# EAGLE design 12vRelayDriver (EAGLE 9.6.2)
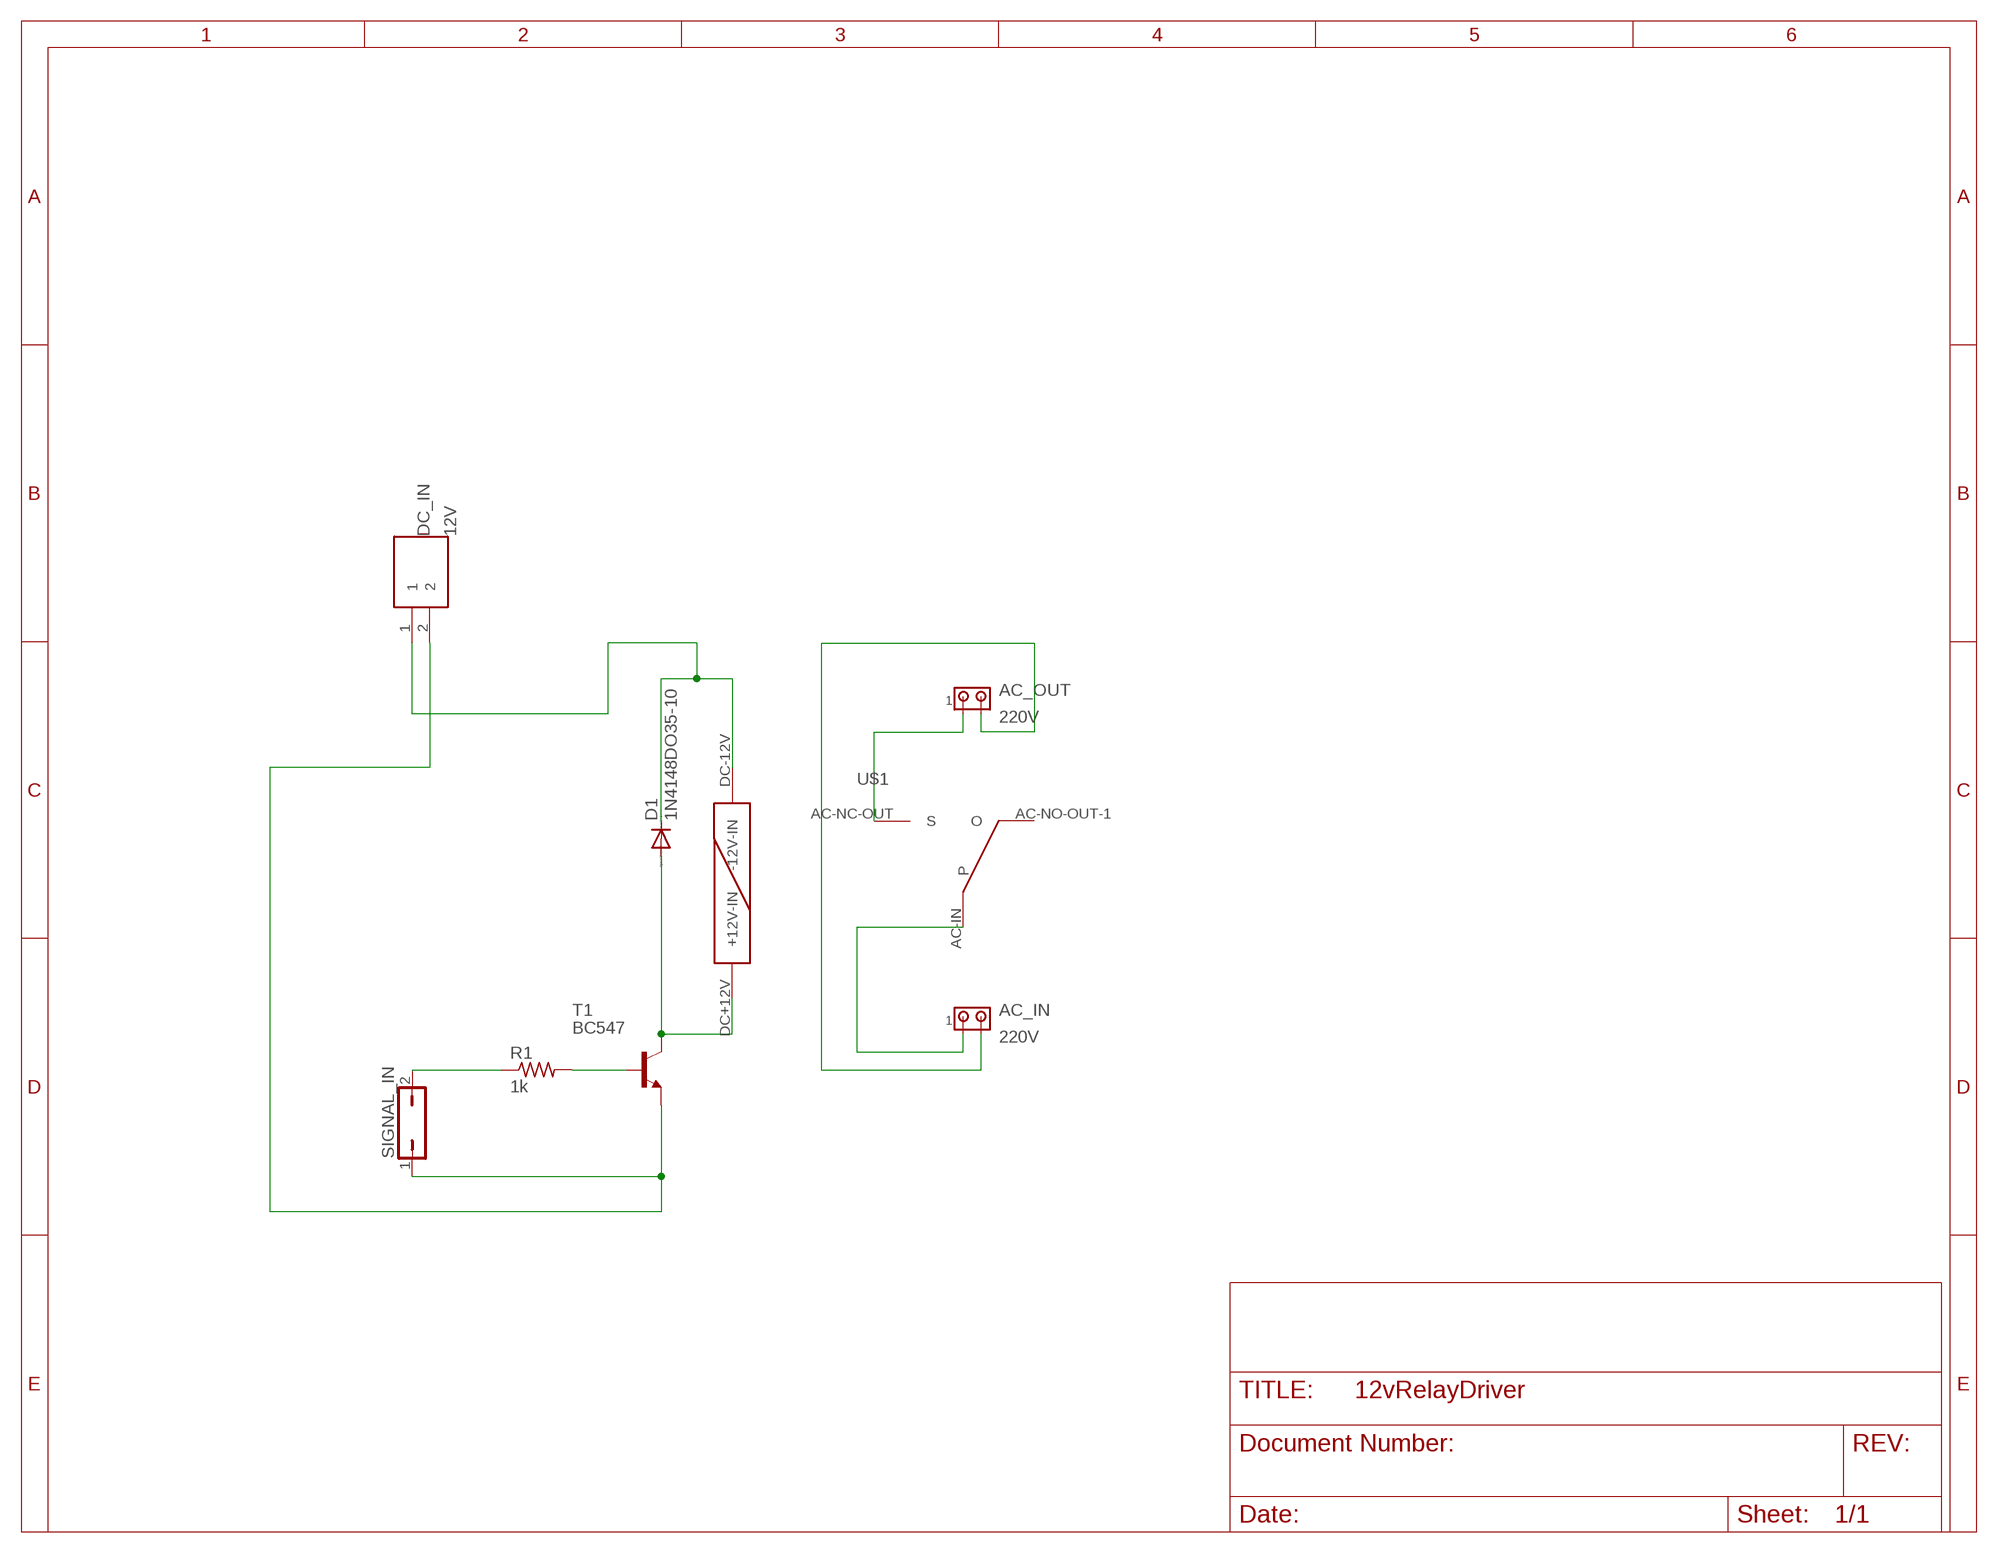
[diagram p0: schematic, sheet 1]

## Parts
AC_IN  220V  MTA02-156  [1X2MTA]
AC_OUT  220V  MTA02-156  [1X2MTA]
D1  1N4148DO35-10  [DO35-10]
DC_IN  12V  440055-2  [TE_440055-2]
R1  1k  R-US_0204/7  [0204/7]
SIGNAL_IN  JP1Q  [JP1]
T1  BC547  [TO92]
U$1  GU-D-2-6  [GU-D-2-6]

## Nets
N$1: D1.A T1.3(C) U$1.DC+12V(+12V-IN)
N$2 [AC_VOLTAGE]: AC_OUT.1 U$1.AC-NC-OUT(S)
N$3 [AC_VOLTAGE]: AC_IN.2 AC_OUT.2
N$4: R1.2 T1.2(B)
N$5: R1.1 SIGNAL_IN.2
N$6 [AC_VOLTAGE]: AC_IN.1 U$1.AC-IN(P)
N$7: D1.C DC_IN.1 U$1.DC-12V(-12V-IN)
N$8: DC_IN.2 SIGNAL_IN.1 T1.1(E)
Unconnected: U$1.AC-NO-OUT-1(O)

## Library data of the parts
AC_IN AC_OUT = con-amp:MTA02-156: AMP connector
D1 = diode:1N4148: DIODE high speed (Philips)
DC_IN = 440055-2:440055-2: Check availability <https://pricing.snapeda.com/parts/440055-2/TE%20Connectivity/view-part?ref=eda>; AVAILABILITY: In Stock; CENTERLINE_PITCH: 2 mm[.079 in]; COMMENT: 440055-2; DESCRIPTION: 2.0MM,HDR,2POS,R/A; EU_ROHS_COMPLIANCE: Compliant; MF: TE Connectivity; MP: 440055-2; NUMBER_OF_POSITIONS: 2; PACKAGE: None; PRICE: None; PRODUCT_TYPE: Connector; PURCHASE-URL: https://pricing.snapeda.com/search/part/440055-2/?ref=eda
R1 = rcl:R-US_: RESISTOR, American symbol
SIGNAL_IN = jumper:JP1Q: JUMPER
T1 = BC547:BC547: NPN TRANSISTOR; AVAILABILITY: Warning; DESCRIPTION: Trans Npn 45v 0.1a To-92; MF: Fairchild Semiconductor; MP: BC547; PACKAGE: TO-92 Fairchild Semiconductor; PRICE: 0.06 USD
U$1 = goodsky:GU-D-2-6: GoodSky GU-D T-shaped 12vDC/240VAC 30A relay (6PIN- 2 Common Terminals)

## Net classes
0 default: width 0.813 mm, drill 0.203 mm, clearance 0.203 mm
1 AC_VOLTAGE: width 1.626 mm, drill 0.254 mm, clearance 0.203 mm

## Board
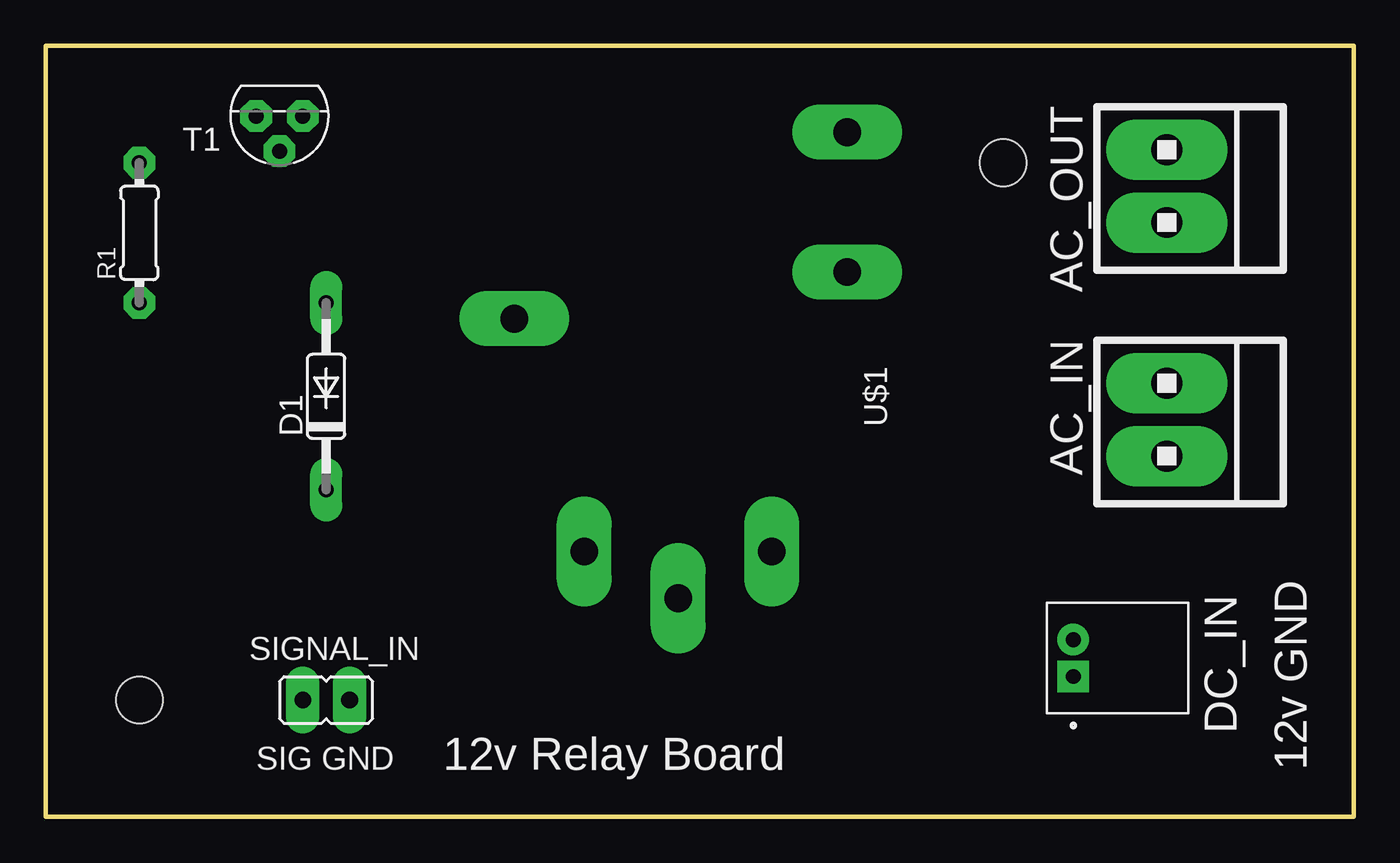
[diagram p1: board, top side]
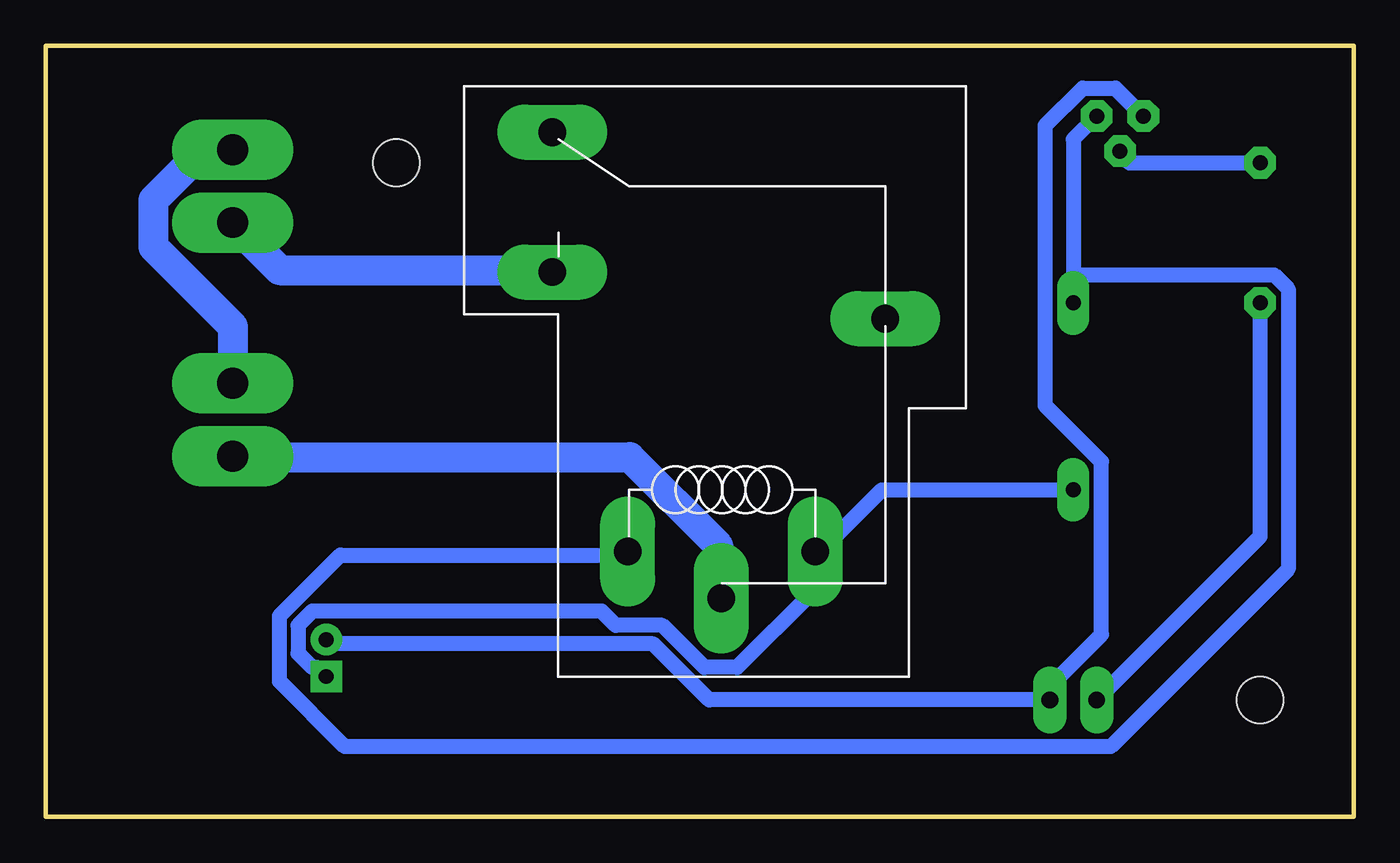
[diagram p2: board, bottom side, seen from below]

Size 71.12 x 41.91 mm. Coordinates in mm from the lower left corner, seen from the top.
Outline: 71.12,0 0,0 0,41.91 71.12,41.91 71.12,0
Copper layers (1*16): Top 0.035mm / dielectric 1.5mm / Bottom 0.035mm
Design rules "PCB_at_home": minimum track width 32mil, minimum drill 10mil, track to track 8mil, track to pad 8mil, pad to pad 8mil, via to via 8mil, smd to smd 8mil, copper to edge 8mil, drill to drill 8mil, minimum pad ring 18mil, minimum via ring 18mil, stop-mask expansion 2mil, vias tented up to drill 20mil, thermal gap 10mil
Holes 2.54 mm at 5.08,6.35 52.07,35.56

### Footprints (pad centres in the part's own frame; a part is rotated, then mirrored left to right if it is on the bottom)
1X2MTA = drill 1.676 long: 1 1.981,0; 2 -1.981,0
DO35-10 = drill 0.813 long: A 5.08,0; C -5.08,0
TE_440055-2 = drill 0.8 pad 1.15 square: 1 0,0 | drill 0.8 pad 1.15: 2 2.007,0
0204/7 = drill 0.813 octagon: 1 -3.81,0; 2 3.81,0
JP1 = drill 0.914 long: 1 0,-1.27; 2 0,1.27
TO92 = drill 0.813 pad 1.422 octagon: 1 1.27,0; 2 0,1.905; 3 -1.27,0
GU-D-2-6 = drill 1.5 pad 1.93 long: AC-IN 4.26,8.8; AC-NC-OUT 22,-0.4; AC-NO-OUT-1 29.6,-0.4; AC-NO-OUT-2 19.46,17.7; DC+12V 6.8,3.7; DC-12V 6.8,13.9

### Placement (x,y rotation side)
AC_IN  60.96,21.59 270 top
AC_OUT  60.96,34.29 270 top
D1  15.24,22.86 90 top
DC_IN  55.88,7.62 90 top
R1  5.08,31.75 90 top
SIGNAL_IN  15.24,6.35 90 top
T1  12.7,38.1 180 top
U$1  43.18,7.62 90 top

### Tracks (layer width: path | path; a pad name or v marks a point on that pad's centre or on a via)
N$1
  Bottom 0.813: T1.3 15.24,36.83 D1.A 14.99,29.46 4.32,29.46 3.56,28.7 3.56,13.46 13.21,3.81 54.86,3.81 58.42,7.37 58.42,10.92 55.12,14.22 39.62,14.22 U$1.DC+12V
N$2
  Bottom 1.626: U$1.AC-NC-OUT 43.69,29.72 58.42,29.72 60.96,32.26 AC_OUT.1
N$3
  Bottom 1.626: AC_IN.2 60.96,26.67 65.28,30.99 65.28,33.53 62.74,36.07 60.96,36.07 AC_OUT.2
N$4
  Bottom 0.813: R1.2 12.19,35.56 12.7,36.07 T1.2
N$5
  Bottom 0.813: R1.1 5.08,15.24 SIGNAL_IN.2
N$6
  Bottom 1.626: U$1.AC-IN 34.54,11.94 34.54,14.73 39.37,19.56 60.96,19.56 AC_IN.1
N$7
  Bottom 0.813: DC_IN.1 56.39,8.13 56.64,8.13 57.4,8.89 57.4,10.41 56.64,11.18 40.89,11.18 40.13,10.41 37.59,10.41 35.31,8.13 33.53,8.13 29.46,12.19 29.46,14.22 U$1.DC-12V 28.96,14.48 25.65,17.78 D1.C
N$8
  Bottom 0.813: DC_IN.2 55.88,9.4 38.1,9.4 35.05,6.35 SIGNAL_IN.1 16.26,6.6 16.26,7.37 13.72,9.91 13.72,19.3 16.76,22.35 16.76,37.59 14.73,39.62 12.95,39.62 T1.1

### Text on the board
tPlace: SIG GND | 12v Relay Board | 12v GND